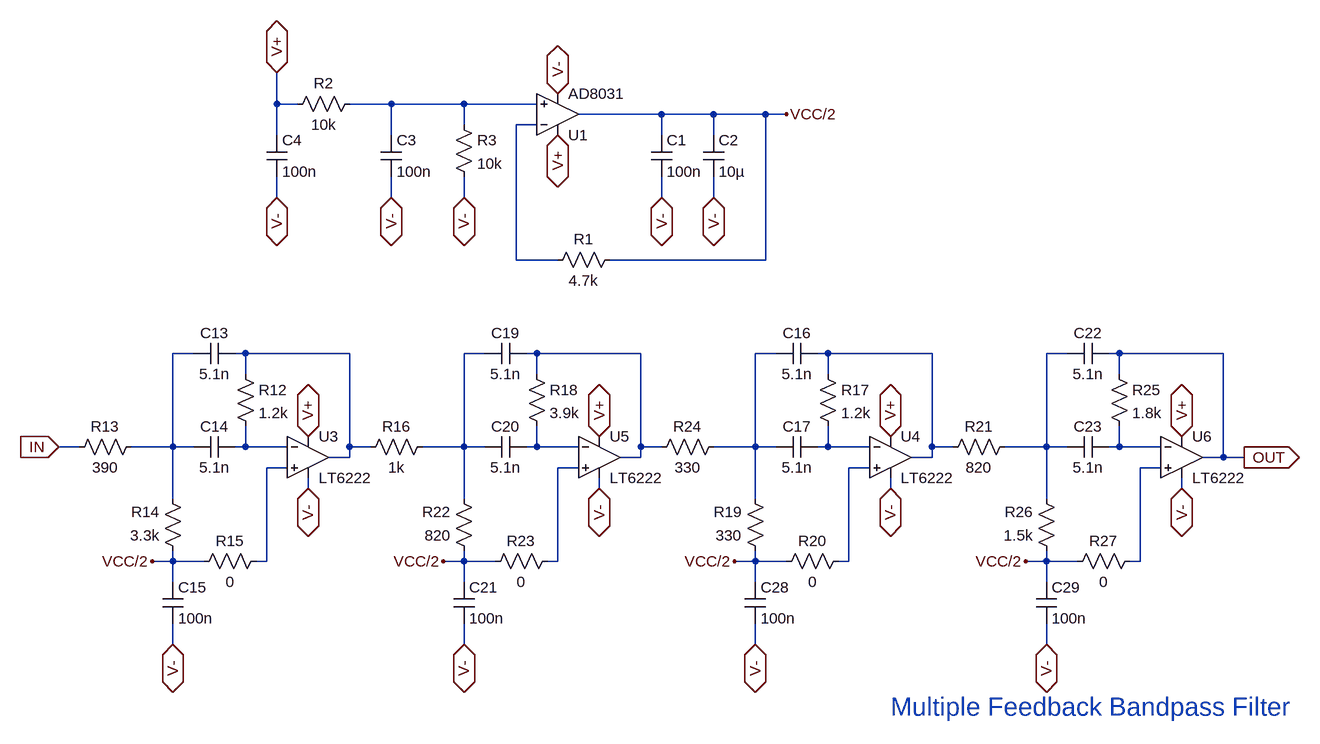
[diagram p0: schematic AHOI_BPF.asc]
AHOI_BPF.asc, the LTspice schematic file:
Version 4.1
SHEET 1 5444 976
WIRE 1552 -592 1552 -640
WIRE 1584 -592 1552 -592
WIRE 1728 -592 1664 -592
WIRE 1840 -592 1728 -592
WIRE 1952 -592 1840 -592
WIRE 2144 -576 2016 -576
WIRE 2224 -576 2144 -576
WIRE 2304 -576 2224 -576
WIRE 2336 -576 2304 -576
WIRE 1840 -560 1840 -592
WIRE 1952 -560 1920 -560
WIRE 1552 -544 1552 -592
WIRE 1728 -544 1728 -592
WIRE 2144 -544 2144 -576
WIRE 2224 -544 2224 -576
WIRE 1552 -448 1552 -480
WIRE 1728 -448 1728 -480
WIRE 1840 -448 1840 -480
WIRE 2144 -448 2144 -480
WIRE 2224 -448 2224 -480
WIRE 1920 -352 1920 -560
WIRE 1984 -352 1920 -352
WIRE 2304 -352 2304 -576
WIRE 2304 -352 2064 -352
WIRE 1424 -208 1392 -208
WIRE 1504 -208 1488 -208
WIRE 1664 -208 1504 -208
WIRE 1872 -208 1840 -208
WIRE 1952 -208 1936 -208
WIRE 2112 -208 1952 -208
WIRE 2320 -208 2288 -208
WIRE 2400 -208 2384 -208
WIRE 2560 -208 2400 -208
WIRE 2768 -208 2736 -208
WIRE 2848 -208 2832 -208
WIRE 3008 -208 2848 -208
WIRE 1504 -176 1504 -208
WIRE 1952 -176 1952 -208
WIRE 2400 -176 2400 -208
WIRE 2848 -176 2848 -208
WIRE 1248 -64 1216 -64
WIRE 1392 -64 1392 -208
WIRE 1392 -64 1328 -64
WIRE 1424 -64 1392 -64
WIRE 1504 -64 1504 -96
WIRE 1504 -64 1488 -64
WIRE 1568 -64 1504 -64
WIRE 1664 -64 1664 -208
WIRE 1696 -64 1664 -64
WIRE 1840 -64 1840 -208
WIRE 1840 -64 1776 -64
WIRE 1872 -64 1840 -64
WIRE 1952 -64 1952 -96
WIRE 1952 -64 1936 -64
WIRE 2016 -64 1952 -64
WIRE 2112 -64 2112 -208
WIRE 2144 -64 2112 -64
WIRE 2288 -64 2288 -208
WIRE 2288 -64 2224 -64
WIRE 2320 -64 2288 -64
WIRE 2400 -64 2400 -96
WIRE 2400 -64 2384 -64
WIRE 2464 -64 2400 -64
WIRE 2560 -64 2560 -208
WIRE 2592 -64 2560 -64
WIRE 2736 -64 2736 -208
WIRE 2736 -64 2672 -64
WIRE 2768 -64 2736 -64
WIRE 2848 -64 2848 -96
WIRE 2848 -64 2832 -64
WIRE 2912 -64 2848 -64
WIRE 1664 -48 1664 -64
WIRE 1664 -48 1632 -48
WIRE 2112 -48 2112 -64
WIRE 2112 -48 2080 -48
WIRE 2560 -48 2560 -64
WIRE 2560 -48 2528 -48
WIRE 3008 -48 3008 -208
WIRE 3008 -48 2976 -48
WIRE 3040 -48 3008 -48
WIRE 1568 -32 1536 -32
WIRE 2016 -32 1984 -32
WIRE 2464 -32 2432 -32
WIRE 2912 -32 2880 -32
WIRE 1600 0 1600 -16
WIRE 2048 0 2048 -16
WIRE 2496 0 2496 -16
WIRE 2944 0 2944 -16
WIRE 1392 16 1392 -64
WIRE 1840 16 1840 -64
WIRE 2288 16 2288 -64
WIRE 2736 16 2736 -64
WIRE 1392 112 1392 96
WIRE 1392 112 1360 112
WIRE 1440 112 1392 112
WIRE 1536 112 1536 -32
WIRE 1536 112 1520 112
WIRE 1840 112 1840 96
WIRE 1840 112 1808 112
WIRE 1888 112 1840 112
WIRE 1984 112 1984 -32
WIRE 1984 112 1968 112
WIRE 2288 112 2288 96
WIRE 2288 112 2256 112
WIRE 2336 112 2288 112
WIRE 2432 112 2432 -32
WIRE 2432 112 2416 112
WIRE 2736 112 2736 96
WIRE 2736 112 2704 112
WIRE 2784 112 2736 112
WIRE 2880 112 2880 -32
WIRE 2880 112 2864 112
WIRE 1392 144 1392 112
WIRE 1840 144 1840 112
WIRE 2288 144 2288 112
WIRE 2736 144 2736 112
WIRE 1392 240 1392 208
WIRE 1840 240 1840 208
WIRE 2288 240 2288 208
WIRE 2736 240 2736 208
FLAG 1600 -80 V+
IOPIN 1600 -80 BiDir
FLAG 2048 -80 V+
IOPIN 2048 -80 BiDir
FLAG 2496 -80 V+
IOPIN 2496 -80 BiDir
FLAG 2944 -80 V+
IOPIN 2944 -80 BiDir
FLAG 1600 0 V-
IOPIN 1600 0 BiDir
FLAG 1392 240 V-
IOPIN 1392 240 BiDir
FLAG 1840 240 V-
IOPIN 1840 240 BiDir
FLAG 2048 0 V-
IOPIN 2048 0 BiDir
FLAG 2496 0 V-
IOPIN 2496 0 BiDir
FLAG 2288 240 V-
IOPIN 2288 240 BiDir
FLAG 2944 0 V-
IOPIN 2944 0 BiDir
FLAG 2736 240 V-
IOPIN 2736 240 BiDir
FLAG 1216 -64 IN
IOPIN 1216 -64 In
FLAG 3040 -48 OUT
IOPIN 3040 -48 Out
FLAG 2336 -576 VCC/2
FLAG 1552 -640 V+
IOPIN 1552 -640 BiDir
FLAG 1552 -448 V-
IOPIN 1552 -448 BiDir
FLAG 1728 -448 V-
IOPIN 1728 -448 BiDir
FLAG 1840 -448 V-
IOPIN 1840 -448 BiDir
FLAG 2144 -448 V-
IOPIN 2144 -448 BiDir
FLAG 2224 -448 V-
IOPIN 2224 -448 BiDir
FLAG 1360 112 VCC/2
FLAG 1808 112 VCC/2
FLAG 2256 112 VCC/2
FLAG 2704 112 VCC/2
FLAG 1984 -608 V-
IOPIN 1984 -608 BiDir
FLAG 1984 -544 V+
IOPIN 1984 -544 BiDir
SYMBOL OpAmps\\LT6222 1600 -48 R0
SYMATTR InstName U3
SYMBOL res 1488 -192 R0
SYMATTR InstName R12
SYMATTR Value 1.2k
SYMBOL cap 1488 -224 R90
WINDOW 0 0 32 VBottom 2
WINDOW 3 32 32 VTop 2
SYMATTR InstName C13
SYMATTR Value 5.1n
SYMBOL cap 1488 -80 R90
WINDOW 0 0 32 VBottom 2
WINDOW 3 32 32 VTop 2
SYMATTR InstName C14
SYMATTR Value 5.1n
SYMBOL res 1344 -80 R90
WINDOW 0 0 56 VBottom 2
WINDOW 3 32 56 VTop 2
SYMATTR InstName R13
SYMATTR Value 390
SYMBOL res 1408 112 R180
WINDOW 0 36 76 Left 2
WINDOW 3 36 40 Left 2
SYMATTR InstName R14
SYMATTR Value 3.3k
SYMBOL res 1424 128 R270
WINDOW 0 32 56 VTop 2
WINDOW 3 0 56 VBottom 2
SYMATTR InstName R15
SYMATTR Value 0
SYMBOL cap 1376 144 R0
SYMATTR InstName C15
SYMATTR Value 100n
SYMBOL res 1792 -80 R90
WINDOW 0 0 56 VBottom 2
WINDOW 3 32 56 VTop 2
SYMATTR InstName R16
SYMATTR Value 1k
SYMBOL OpAmps\\LT6222 2496 -48 R0
SYMATTR InstName U4
SYMBOL res 2384 -192 R0
SYMATTR InstName R17
SYMATTR Value 1.2k
SYMBOL cap 2384 -224 R90
WINDOW 0 0 32 VBottom 2
WINDOW 3 32 32 VTop 2
SYMATTR InstName C16
SYMATTR Value 5.1n
SYMBOL cap 2384 -80 R90
WINDOW 0 0 32 VBottom 2
WINDOW 3 32 32 VTop 2
SYMATTR InstName C17
SYMATTR Value 5.1n
SYMBOL res 2304 112 R180
WINDOW 0 36 76 Left 2
WINDOW 3 36 40 Left 2
SYMATTR InstName R19
SYMATTR Value 330
SYMBOL res 2320 128 R270
WINDOW 0 32 56 VTop 2
WINDOW 3 0 56 VBottom 2
SYMATTR InstName R20
SYMATTR Value 0
SYMBOL res 2688 -80 R90
WINDOW 0 0 56 VBottom 2
WINDOW 3 32 56 VTop 2
SYMATTR InstName R21
SYMATTR Value 820
SYMBOL OpAmps\\LT6222 2048 -48 R0
SYMATTR InstName U5
SYMBOL res 1936 -192 R0
SYMATTR InstName R18
SYMATTR Value 3.9k
SYMBOL cap 1936 -224 R90
WINDOW 0 0 32 VBottom 2
WINDOW 3 32 32 VTop 2
SYMATTR InstName C19
SYMATTR Value 5.1n
SYMBOL cap 1936 -80 R90
WINDOW 0 0 32 VBottom 2
WINDOW 3 32 32 VTop 2
SYMATTR InstName C20
SYMATTR Value 5.1n
SYMBOL res 1856 112 R180
WINDOW 0 36 76 Left 2
WINDOW 3 36 40 Left 2
SYMATTR InstName R22
SYMATTR Value 820
SYMBOL res 1872 128 R270
WINDOW 0 32 56 VTop 2
WINDOW 3 0 56 VBottom 2
SYMATTR InstName R23
SYMATTR Value 0
SYMBOL cap 1824 144 R0
SYMATTR InstName C21
SYMATTR Value 100n
SYMBOL res 2240 -80 R90
WINDOW 0 0 56 VBottom 2
WINDOW 3 32 56 VTop 2
SYMATTR InstName R24
SYMATTR Value 330
SYMBOL OpAmps\\LT6222 2944 -48 R0
SYMATTR InstName U6
SYMBOL res 2832 -192 R0
SYMATTR InstName R25
SYMATTR Value 1.8k
SYMBOL cap 2832 -224 R90
WINDOW 0 0 32 VBottom 2
WINDOW 3 32 32 VTop 2
SYMATTR InstName C22
SYMATTR Value 5.1n
SYMBOL cap 2832 -80 R90
WINDOW 0 0 32 VBottom 2
WINDOW 3 32 32 VTop 2
SYMATTR InstName C23
SYMATTR Value 5.1n
SYMBOL res 2752 112 R180
WINDOW 0 36 76 Left 2
WINDOW 3 36 40 Left 2
SYMATTR InstName R26
SYMATTR Value 1.5k
SYMBOL res 2768 128 R270
WINDOW 0 32 56 VTop 2
WINDOW 3 0 56 VBottom 2
SYMATTR InstName R27
SYMATTR Value 0
SYMBOL cap 2272 144 R0
SYMATTR InstName C28
SYMATTR Value 100n
SYMBOL cap 2720 144 R0
SYMATTR InstName C29
SYMATTR Value 100n
SYMBOL OpAmps\\AD8031 1984 -512 M180
SYMATTR InstName U1
SYMBOL res 2080 -368 R90
WINDOW 0 0 56 VBottom 2
WINDOW 3 32 56 VTop 2
SYMATTR InstName R1
SYMATTR Value 4.7k
SYMBOL cap 2128 -544 R0
SYMATTR InstName C1
SYMATTR Value 100n
SYMBOL cap 2208 -544 R0
SYMATTR InstName C2
SYMATTR Value 10µ
SYMBOL res 1680 -608 R90
WINDOW 0 0 56 VBottom 2
WINDOW 3 32 56 VTop 2
SYMATTR InstName R2
SYMATTR Value 10k
SYMBOL cap 1712 -544 R0
SYMATTR InstName C3
SYMATTR Value 100n
SYMBOL res 1824 -576 R0
SYMATTR InstName R3
SYMATTR Value 10k
SYMBOL cap 1536 -544 R0
SYMATTR InstName C4
SYMATTR Value 100n
TEXT 2496 336 Left 4 ;Multiple Feedback Bandpass Filter

The netlist it stands for:
* AHOI_BPF.asc
* U3: LT6222 (symbol OpAmps\LT6222 not available, pins judged from their places): In+=N014 In-=N010 V+=V+ V-=V- OUT=N004
R12 N004 N010 1.2k
C13 N004 N003 5.1n
C14 N010 N003 5.1n
R13 N003 IN 390
R14 VCC/2 N003 3.3k
R15 VCC/2 N014 0
C15 VCC/2 V- 100n
R16 N005 N004 1k
* U4: LT6222 (symbol OpAmps\LT6222 not available, pins judged from their places): In+=N016 In-=N012 V+=V+ V-=V- OUT=N008
R17 N008 N012 1.2k
C16 N008 N007 5.1n
C17 N012 N007 5.1n
R19 VCC/2 N007 330
R20 VCC/2 N016 0
R21 N009 N008 820
* U5: LT6222 (symbol OpAmps\LT6222 not available, pins judged from their places): In+=N015 In-=N011 V+=V+ V-=V- OUT=N006
R18 N006 N011 3.9k
C19 N006 N005 5.1n
C20 N011 N005 5.1n
R22 VCC/2 N005 820
R23 VCC/2 N015 0
C21 VCC/2 V- 100n
R24 N007 N006 330
* U6: LT6222 (symbol OpAmps\LT6222 not available, pins judged from their places): In+=N017 In-=N013 V+=V+ V-=V- OUT=OUT
R25 OUT N013 1.8k
C22 OUT N009 5.1n
C23 N013 N009 5.1n
R26 VCC/2 N009 1.5k
R27 VCC/2 N017 0
C28 VCC/2 V- 100n
C29 VCC/2 V- 100n
X§U1 N001 N002 V+ V- VCC/2 AD8031  ; pins In+ In- V+ V- OUT
R1 VCC/2 N002 4.7k
C1 VCC/2 V- 100n
C2 VCC/2 V- 10µ
R2 N001 V+ 10k
C3 N001 V- 100n
R3 N001 V- 10k
C4 V+ V- 100n
* Multiple Feedback Bandpass Filter
.backanno
.end